# EAGLE design Power_Amp_carlos (EAGLE 6.5.0)
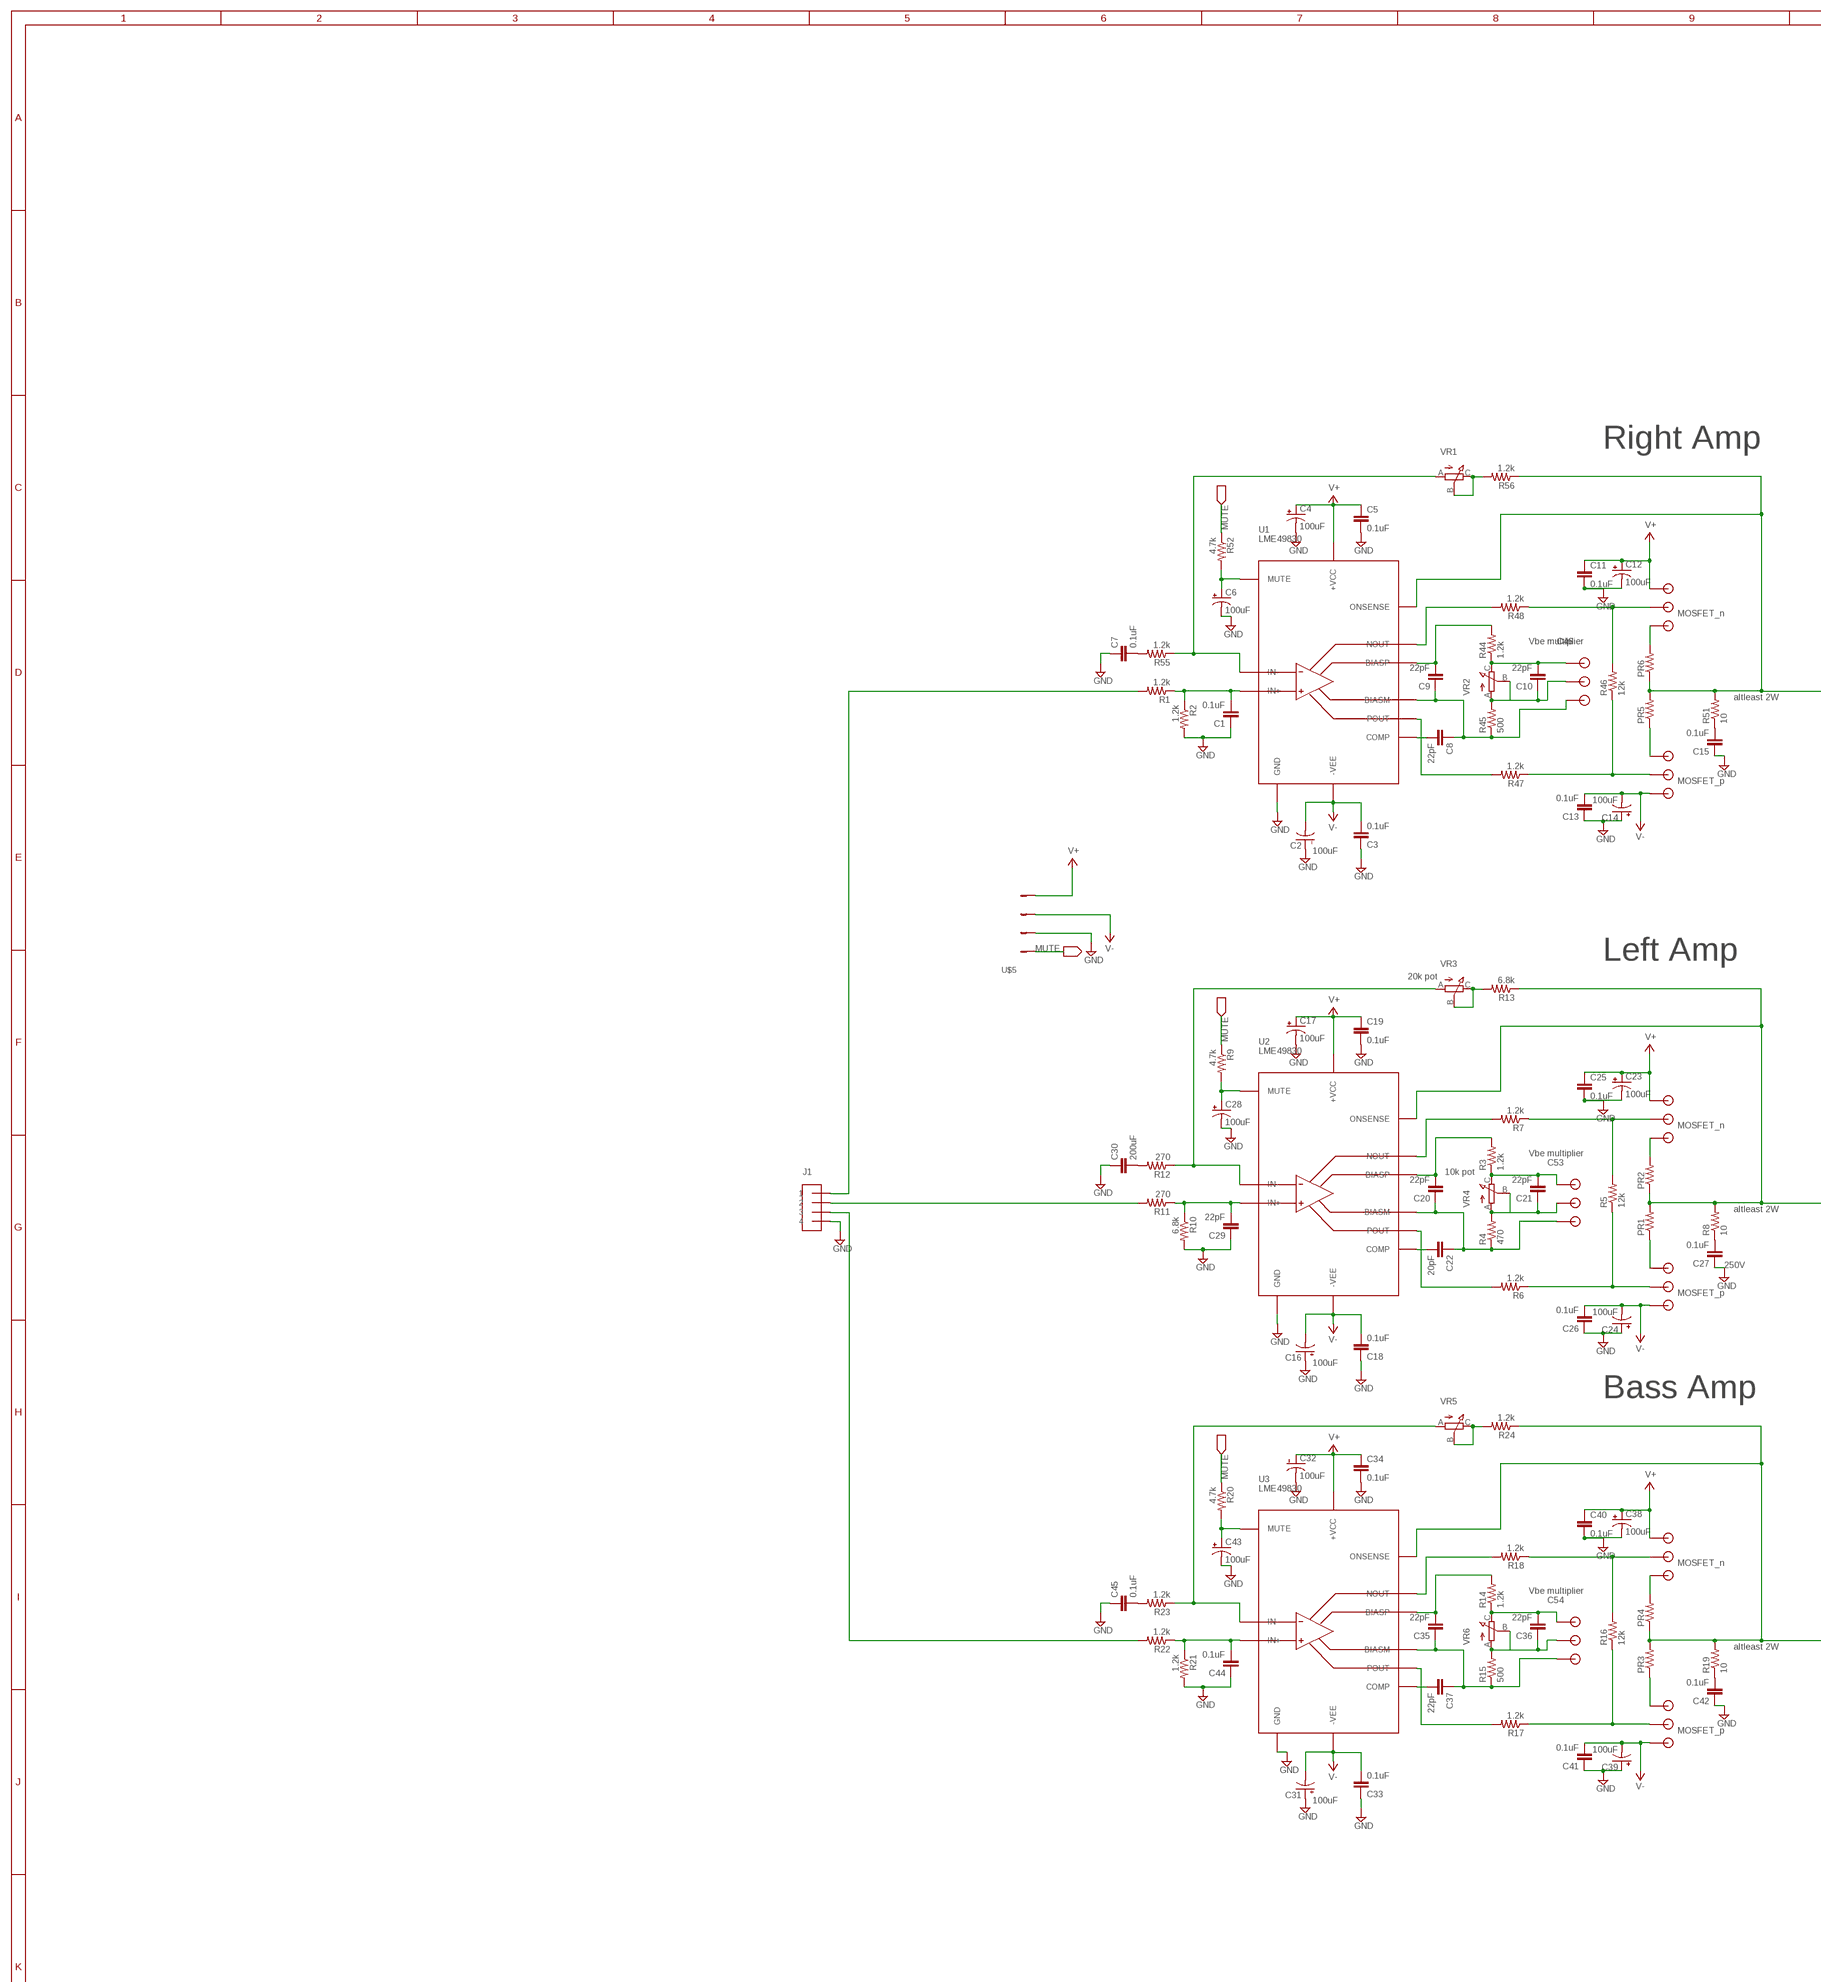
[diagram p0: schematic, sheet 1, part 1 of 3]
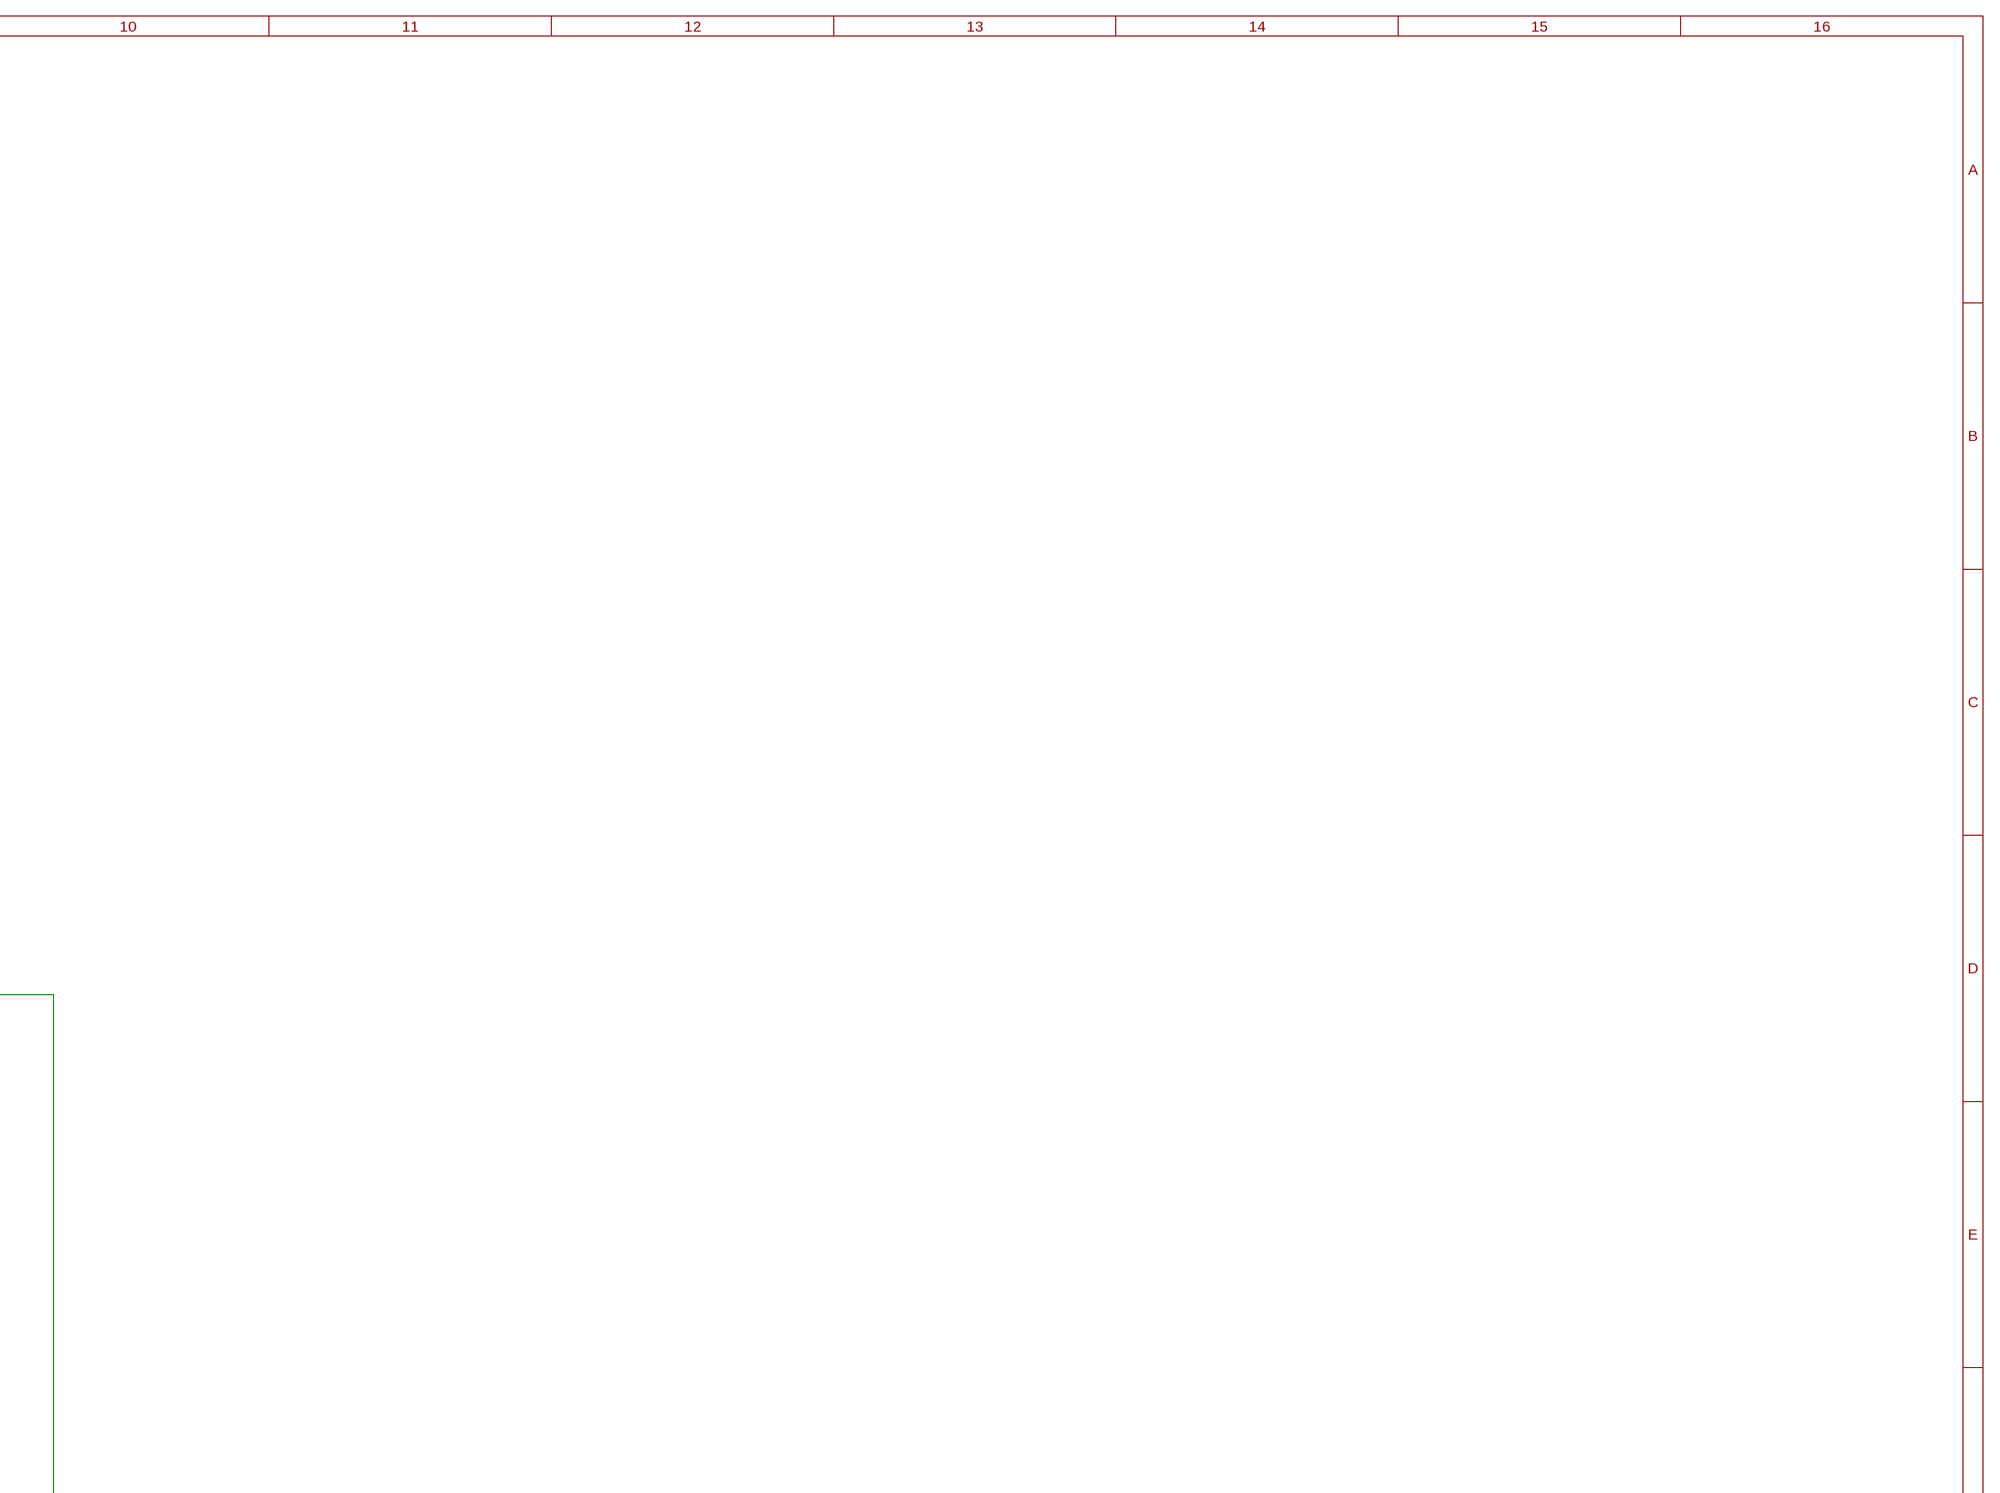
[diagram p1: schematic, sheet 1, part 2 of 3]
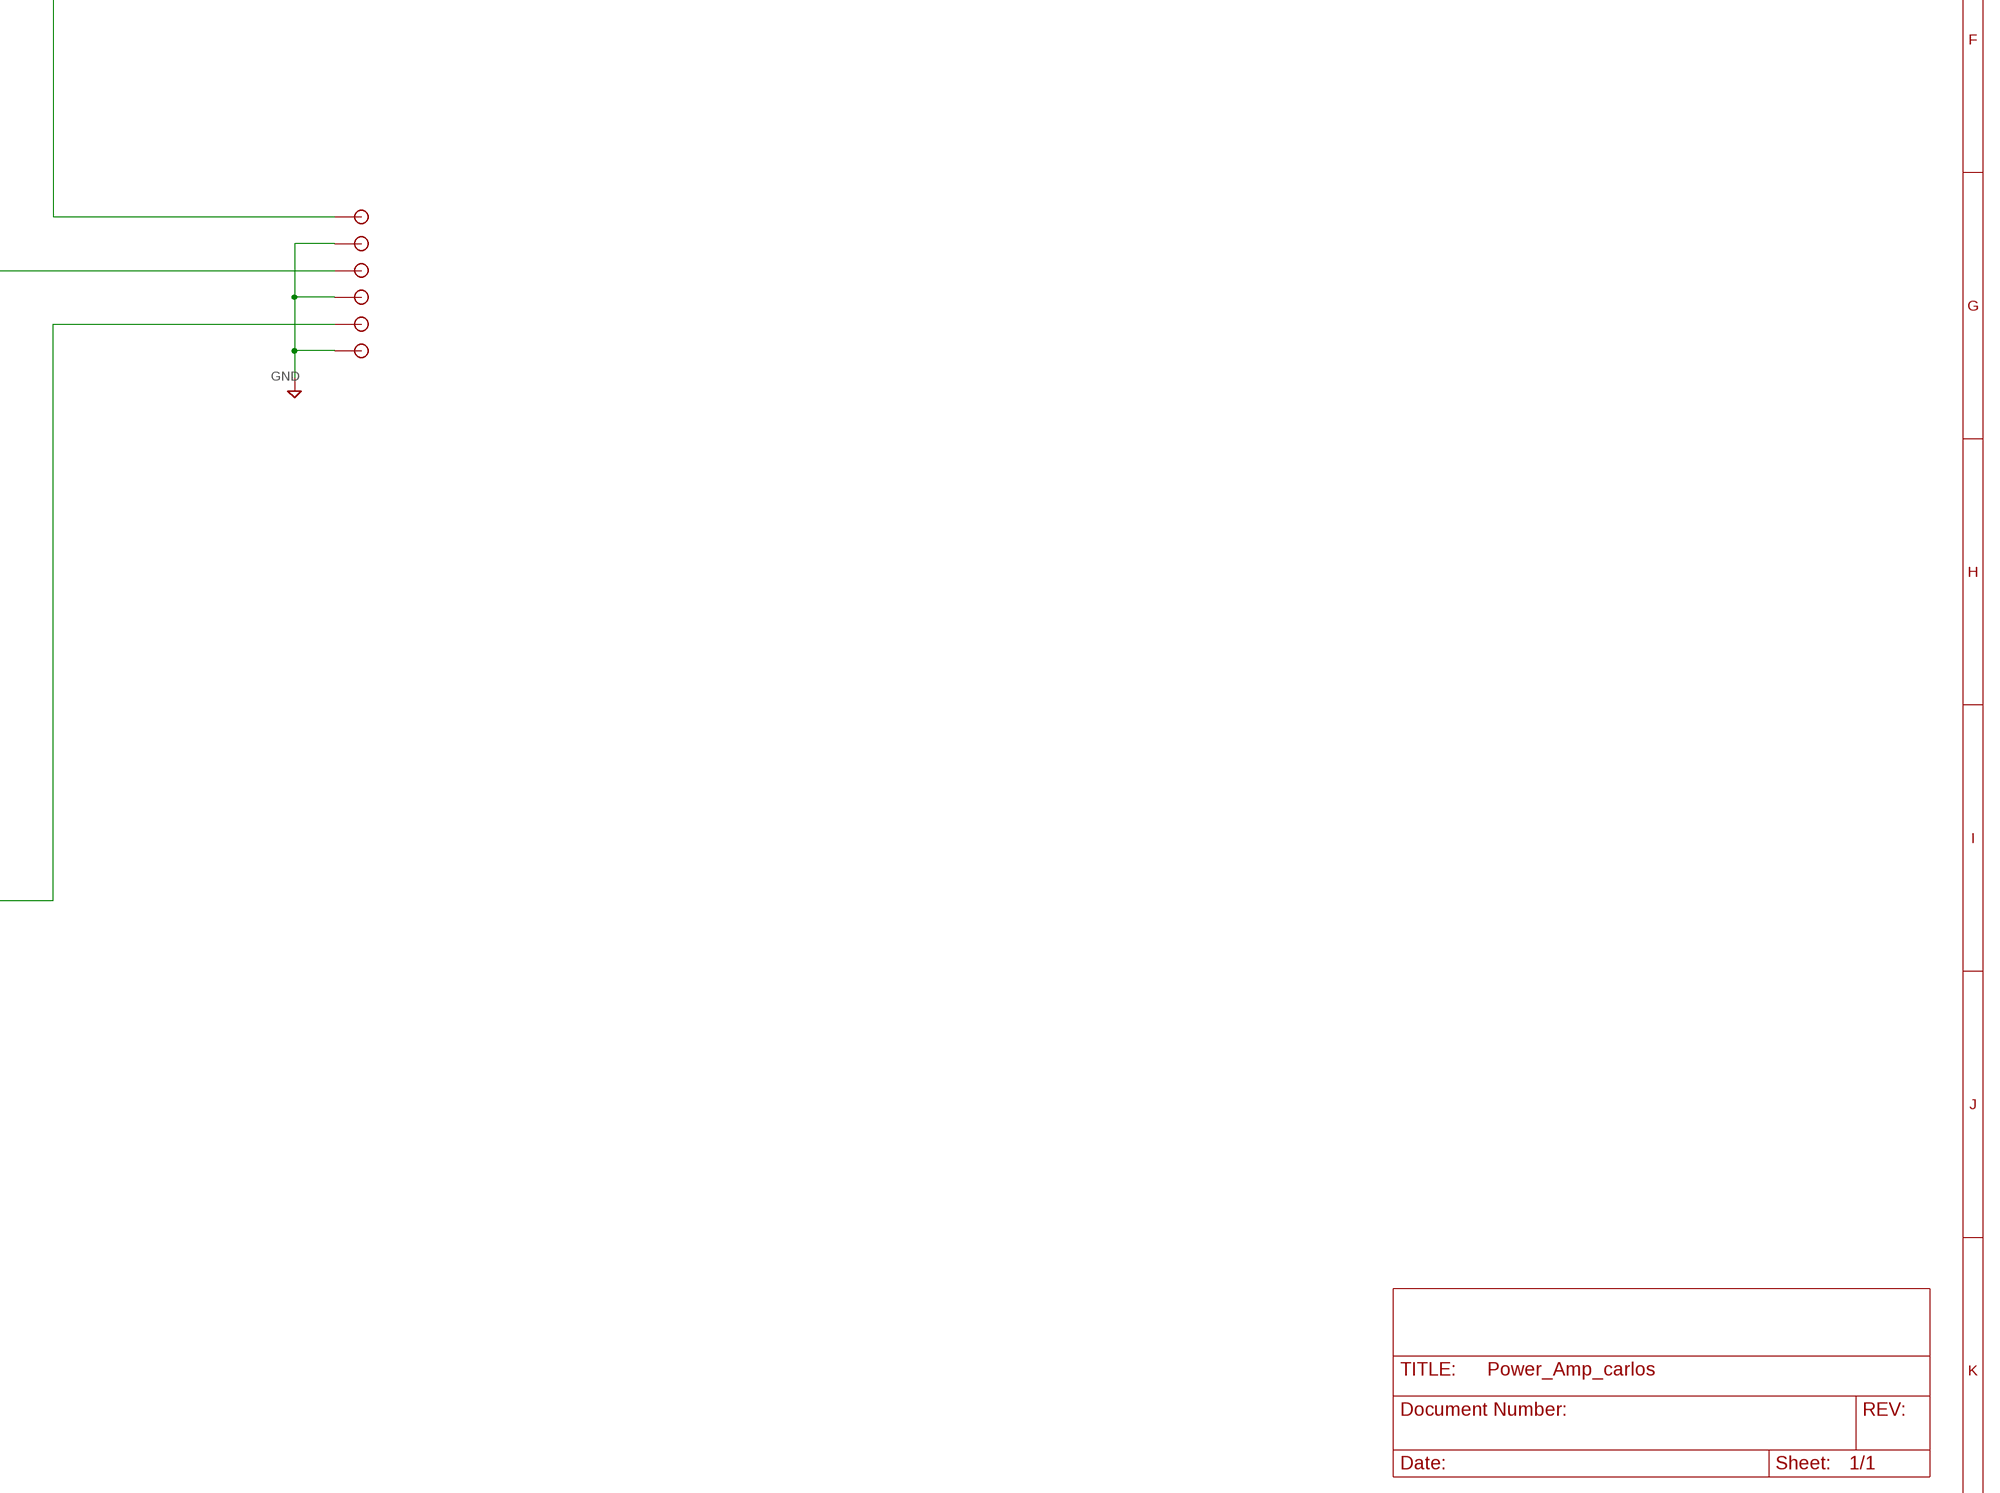
[diagram p2: schematic, sheet 1, part 3 of 3]

## Parts
C1  0.1uF  C-EU050-024X044  [C050-024X044]
C2  100uF  CPOL-USE2.5-6  [E2,5-6]
C3  0.1uF  C-EU050-024X044  [C050-024X044]
C4  100uF  CPOL-USE2.5-6  [E2,5-6]
C5  0.1uF  C-EU050-024X044  [C050-024X044]
C6  100uF  CPOL-USE2.5-6  [E2,5-6]
C7  0.1uF  C-EU050-024X044  [C050-024X044]
C8  22pF  C-EU050-024X044  [C050-024X044]
C9  22pF  C-EU050-024X044  [C050-024X044]
C10  22pF  C-EU050-024X044  [C050-024X044]
C11  0.1uF  C-EU050-024X044  [C050-024X044]
C12  100uF  CPOL-USE2.5-6  [E2,5-6]
C13  0.1uF  C-EU050-024X044  [C050-024X044]
C14  100uF  CPOL-USE2.5-6  [E2,5-6]
C15  0.1uF  C-EU050-024X044  [C050-024X044]
C16  100uF  CPOL-USE2.5-6  [E2,5-6]
C17  100uF  CPOL-USE2.5-6  [E2,5-6]
C18  0.1uF  C-EU050-024X044  [C050-024X044]
C19  0.1uF  C-EU050-024X044  [C050-024X044]
C20  22pF  C-EU050-024X044  [C050-024X044]
C21  22pF  C-EU050-024X044  [C050-024X044]
C22  20pF  C-EU050-024X044  [C050-024X044]
C23  100uF  CPOL-USE2.5-6  [E2,5-6]
C24  100uF  CPOL-USE2.5-6  [E2,5-6]
C25  0.1uF  C-EU050-024X044  [C050-024X044]
C26  0.1uF  C-EU050-024X044  [C050-024X044]
C27  0.1uF  C-EU050-024X044  [C050-024X044]
C28  100uF  CPOL-USE2.5-6  [E2,5-6]
C29  22pF  C-EU050-024X044  [C050-024X044]
C30  200uF  C-EU050-024X044  [C050-024X044]
C31  100uF  CPOL-USE2.5-6  [E2,5-6]
C32  100uF  CPOL-USE2.5-6  [E2,5-6]
C33  0.1uF  C-EU050-024X044  [C050-024X044]
C34  0.1uF  C-EU050-024X044  [C050-024X044]
C35  22pF  C-EU050-024X044  [C050-024X044]
C36  22pF  C-EU050-024X044  [C050-024X044]
C37  22pF  C-EU050-024X044  [C050-024X044]
C38  100uF  CPOL-USE2.5-6  [E2,5-6]
C39  100uF  CPOL-USE2.5-6  [E2,5-6]
C40  0.1uF  C-EU050-024X044  [C050-024X044]
C41  0.1uF  C-EU050-024X044  [C050-024X044]
C42  0.1uF  C-EU050-024X044  [C050-024X044]
C43  100uF  CPOL-USE2.5-6  [E2,5-6]
C44  0.1uF  C-EU050-024X044  [C050-024X044]
C45  0.1uF  C-EU050-024X044  [C050-024X044]
C46  OSTVN03A150  [OSTVN03A150]
C47  1984620  [1984620]
C48  1984620  [1984620]
C49  1984620  [1984620]
C50  1984620  [1984620]
C51  1984620  [1984620]
C52  1984620  [1984620]
C53  OSTVN03A150  [OSTVN03A150]
C54  OSTVN03A150  [OSTVN03A150]
C55  1984659  [1984659]
J1  4_PIN_AMPCONN  [4_PIN_AMPCON]
PR1  R-US_0617/5V  [0617V]
PR2  R-US_0617/5V  [0617V]
PR3  R-US_0617/5V  [0617V]
PR4  R-US_0617/5V  [0617V]
PR5  R-US_0617/5V  [0617V]
PR6  R-US_0617/5V  [0617V]
R1  1.2k  R-US_0204/2V  [0204V]
R2  1.2k  R-US_0204/2V  [0204V]
R3  1.2k  R-US_0204/2V  [0204V]
R4  470  R-US_0204/2V  [0204V]
R5  12k  R-US_0204/2V  [0204V]
R6  1.2k  R-US_0204/2V  [0204V]
R7  1.2k  R-US_0204/2V  [0204V]
R8  10  R-US_0617/5V  [0617V]
R9  4.7k  R-US_0204/2V  [0204V]
R10  6.8k  R-US_0204/2V  [0204V]
R11  270  R-US_0204/2V  [0204V]
R12  270  R-US_0204/2V  [0204V]
R13  6.8k  R-US_0204/2V  [0204V]
R14  1.2k  R-US_0204/2V  [0204V]
R15  500  R-US_0204/2V  [0204V]
R16  12k  R-US_0204/2V  [0204V]
R17  1.2k  R-US_0204/2V  [0204V]
R18  1.2k  R-US_0204/2V  [0204V]
R19  10  R-US_0617/5V  [0617V]
R20  4.7k  R-US_0204/2V  [0204V]
R21  1.2k  R-US_0204/2V  [0204V]
R22  1.2k  R-US_0204/2V  [0204V]
R23  1.2k  R-US_0204/2V  [0204V]
R24  1.2k  R-US_0204/2V  [0204V]
R44  1.2k  R-US_0204/2V  [0204V]
R45  500  R-US_0204/2V  [0204V]
R46  12k  R-US_0204/2V  [0204V]
R47  1.2k  R-US_0204/2V  [0204V]
R48  1.2k  R-US_0204/2V  [0204V]
R51  10  R-US_0617/5V  [0617V]
R52  4.7k  R-US_0204/2V  [0204V]
R55  1.2k  R-US_0204/2V  [0204V]
R56  1.2k  R-US_0204/2V  [0204V]
U1  LME49830  [NDN0015A]
U2  LME49830  [NDN0015A]
U3  LME49830  [NDN0015A]
U$5  SCREW_TERMINAL_4  [SCREW_TERMINAL_4]
VR1  EVM2W  [EVM2W]
VR2  EVM2W  [EVM2W]
VR3  EVM2W  [EVM2W]
VR4  EVM2W  [EVM2W]
VR5  EVM2W  [EVM2W]
VR6  EVM2W  [EVM2W]

## Nets
BASS: J1.3 R22.2
GND: C1.1 C2.+ C3.1 C4.- C5.2 C6.- C7.1 C11.2 C12.- C13.1 C14.+ C15.1 C16.+ C17.- C18.1 C19.2 C23.- C24.+ C25.2 C26.1 C27.1 C28.- C29.1 C30.1 C31.+ C32.- C33.1 C34.2 C38.- C39.+ C40.2 C41.1 C42.1 C43.- C44.1 C45.1 C55.P$2 C55.P$4 C55.P$6 J1.4 R2.2 R10.2 R21.2 U1.P3(GND) U2.P3(GND) U3.P3(GND) U$5.2(S2)
LEFT: J1.2 R11.2
MUTE: R9.1 R20.1 R52.1 U$5.1(S1)
N$1: C21.2 C53.P$1 R3.1 VR4.C
N$2: C21.1 C53.P$2 R4.2 VR4.A VR4.B
N$3: C20.2 R3.2 U2.P12(BIASP)
N$4: R48.2 U1.P14(NOUT)
N$5: C20.1 C22.1 C53.P$3 R4.1 U2.P11(BIASM)
N$6: C22.2 U2.P6(COMP)
N$7: R6.2 U2.P13(POUT)
N$8: C50.P$2 R5.2 R7.1
N$9: C49.P$2 R5.1 R6.1
N$11: C50.P$3 PR2.2
N$12: C55.P$3 PR1.2 PR2.1 R8.2 R13.1 U2.P$8(ONSENSE)
N$13: C27.2 R8.1
N$14: C28.+ R9.2 U2.P2(MUTE)
N$15: R7.2 U2.P14(NOUT)
N$16: C1.2 R1.1 R2.1 U1.P4(IN+)
N$17: C29.2 R10.1 R11.1 U2.P4(IN+)
N$18: C30.2 R12.2
N$19: R12.1 U2.P5(IN-) VR3.A
N$20: R13.2 VR3.B VR3.C
N$22: C49.P$1 PR1.1
N$23: C36.2 C54.P$1 R14.1 VR6.C
N$24: C36.1 C54.P$2 R15.2 VR6.A VR6.B
N$25: C35.2 R14.2 U3.P12(BIASP)
N$26: C35.1 C37.1 C54.P$3 R15.1 U3.P11(BIASM)
N$27: C37.2 U3.P6(COMP)
N$28: R17.2 U3.P13(POUT)
N$30: C51.P$2 R16.2 R18.1
N$31: R55.1 U1.P5(IN-) VR1.A
N$32: C52.P$2 R16.1 R17.1
N$33: C51.P$3 PR4.2
N$35: C42.2 R19.1
N$36: C7.2 R55.2
N$37: C43.+ R20.2 U3.P2(MUTE)
N$38: R18.2 U3.P14(NOUT)
N$39: C44.2 R21.1 R22.1 U3.P4(IN+)
N$40: R56.2 VR1.B VR1.C
N$41: C45.2 R23.2
N$42: R23.1 U3.P5(IN-) VR5.A
N$43: R24.2 VR5.B VR5.C
N$45: C52.P$1 PR3.1
N$65: C10.2 C46.P$1 R44.1 VR2.C
N$66: C8.2 U1.P6(COMP)
N$67: C8.1 C9.1 C46.P$3 R45.1 U1.P11(BIASM)
N$68: C10.1 C46.P$2 R45.2 VR2.A VR2.B
N$69: C9.2 R44.2 U1.P12(BIASP)
N$70: R47.2 U1.P13(POUT)
N$72: C47.P$2 R46.2 R48.1
N$73: C48.P$2 R46.1 R47.1
N$74: C47.P$3 PR6.2
N$75: C55.P$1 PR5.2 PR6.1 R51.2 R56.1 U1.P$8(ONSENSE)
N$77: C55.P$5 PR3.2 PR4.1 R19.2 R24.1 U3.P$8(ONSENSE)
N$84: C15.2 R51.1
N$85: C6.+ R52.2 U1.P2(MUTE)
N$110: C48.P$1 PR5.1
RIGHT: J1.1 R1.2
V+: C4.+ C5.1 C11.1 C12.+ C17.+ C19.1 C23.+ C25.1 C32.+ C34.1 C38.+ C40.1 C47.P$1 C50.P$1 C51.P$1 U1.P15(+VCC) U2.P15(+VCC) U3.P15(+VCC) U$5.4(S4)
V-: C2.- C3.2 C13.2 C14.- C16.- C18.2 C24.- C26.2 C31.- C33.2 C39.- C41.2 C48.P$3 C49.P$3 C52.P$3 U1.P10(-VEE) U2.P10(-VEE) U3.P10(-VEE) U$5.3(S3)

## Notes on the sheet
- Right Amp
- MOSFET_n
- Vbe multiplier
- altleast 2W
- MOSFET_p
- Left Amp
- 20k pot
- MOSFET_n
- Vbe multiplier
- 10k pot
- altleast 2W
- 250V
- MOSFET_p
- Bass Amp
- MOSFET_n
- Vbe multiplier
- altleast 2W
- MOSFET_p

## Library data of the parts
C1 C3 C5 C7-C11 C13 C15 C18-C22 C25-C27 C29 C30 C33-C37 C40-C42 C44 C45 = rcl:C-EU: CAPACITOR, European symbol
C2 C4 C6 C12 C14 C16 C17 C23 C24 C28 C31 C32 C38 C39 C43 = rcl:CPOL-US: POLARIZED CAPACITOR, American symbol
C46 C53 C54 = Amplifier_Parts:OSTVN03A150
C47-C52 = Amplifier_Parts:1984620
C55 = Amplifier_Parts:1984659
J1 = Amplifier_Parts:4_PIN_AMPCONN
PR1-PR6 R1-R24 R44-R48 R51 R52 R55 R56 = rcl:R-US_: RESISTOR, American symbol
U1-U3 = LME49830_1:LME49830: Mono High Fidelity 200 Volt MOSFET Power Amplifier Input Stage with Mute Datasheet: http://www.ti.com/lit/ds/symlink/lme49830.pdf
U$5 = Amplifier_Parts:SCREW_TERMINAL_4
VR1-VR6 = Amplifier_Parts:EVM2W

## Board
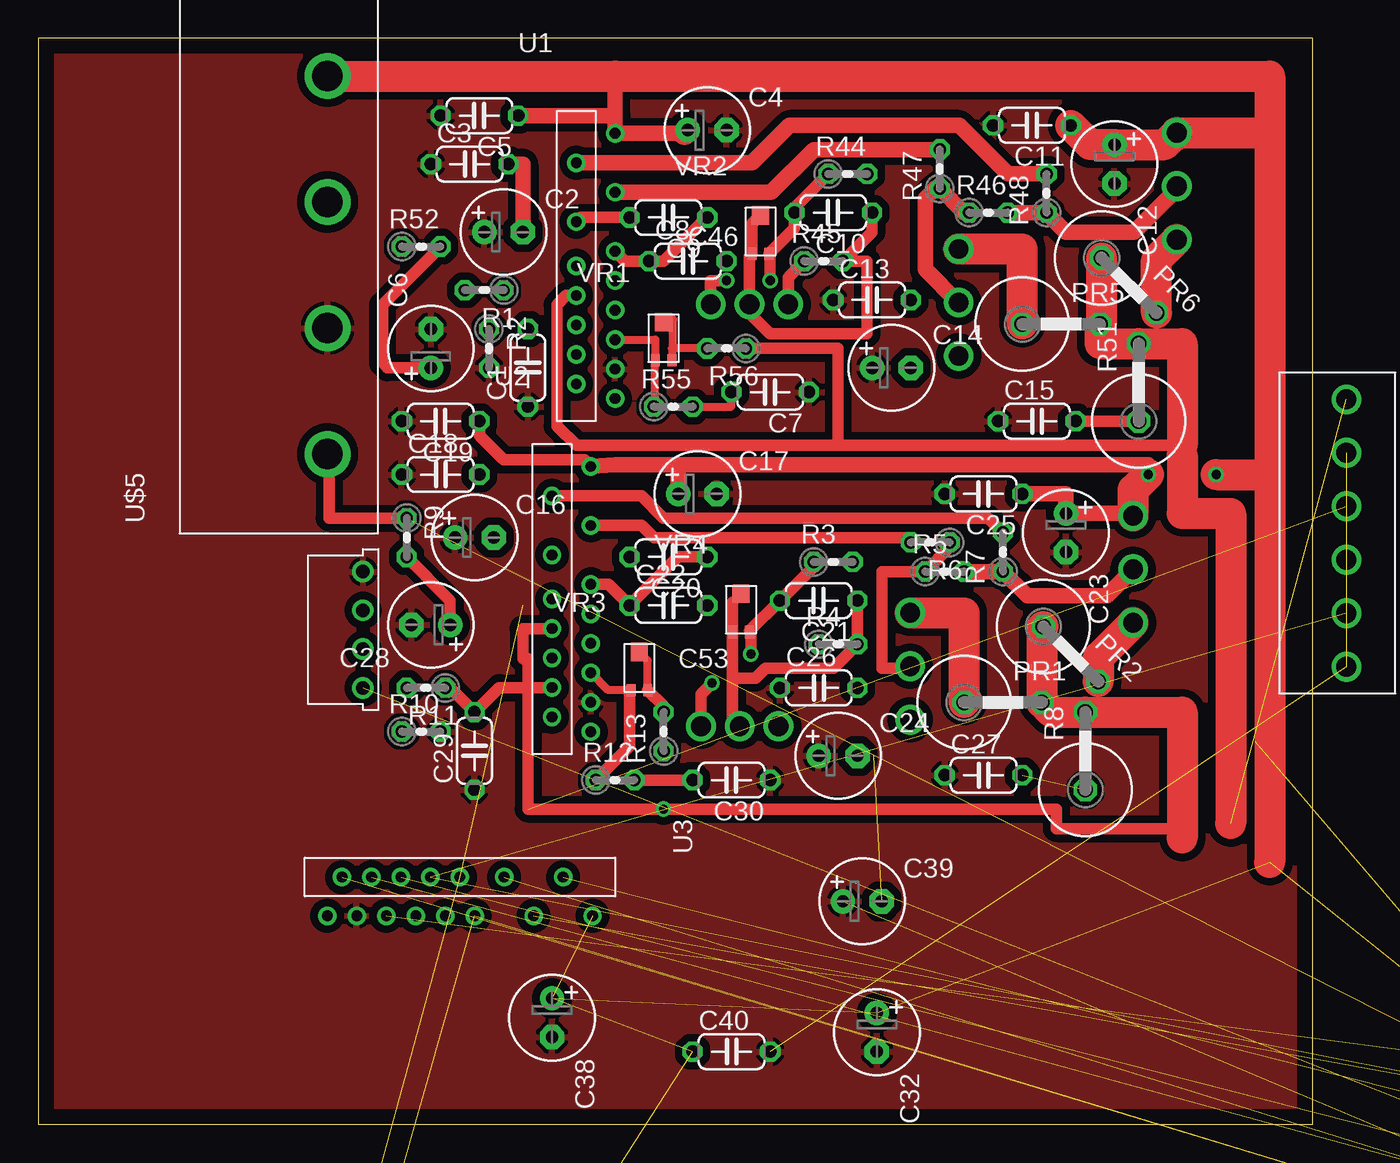
[diagram p3: board, top side]
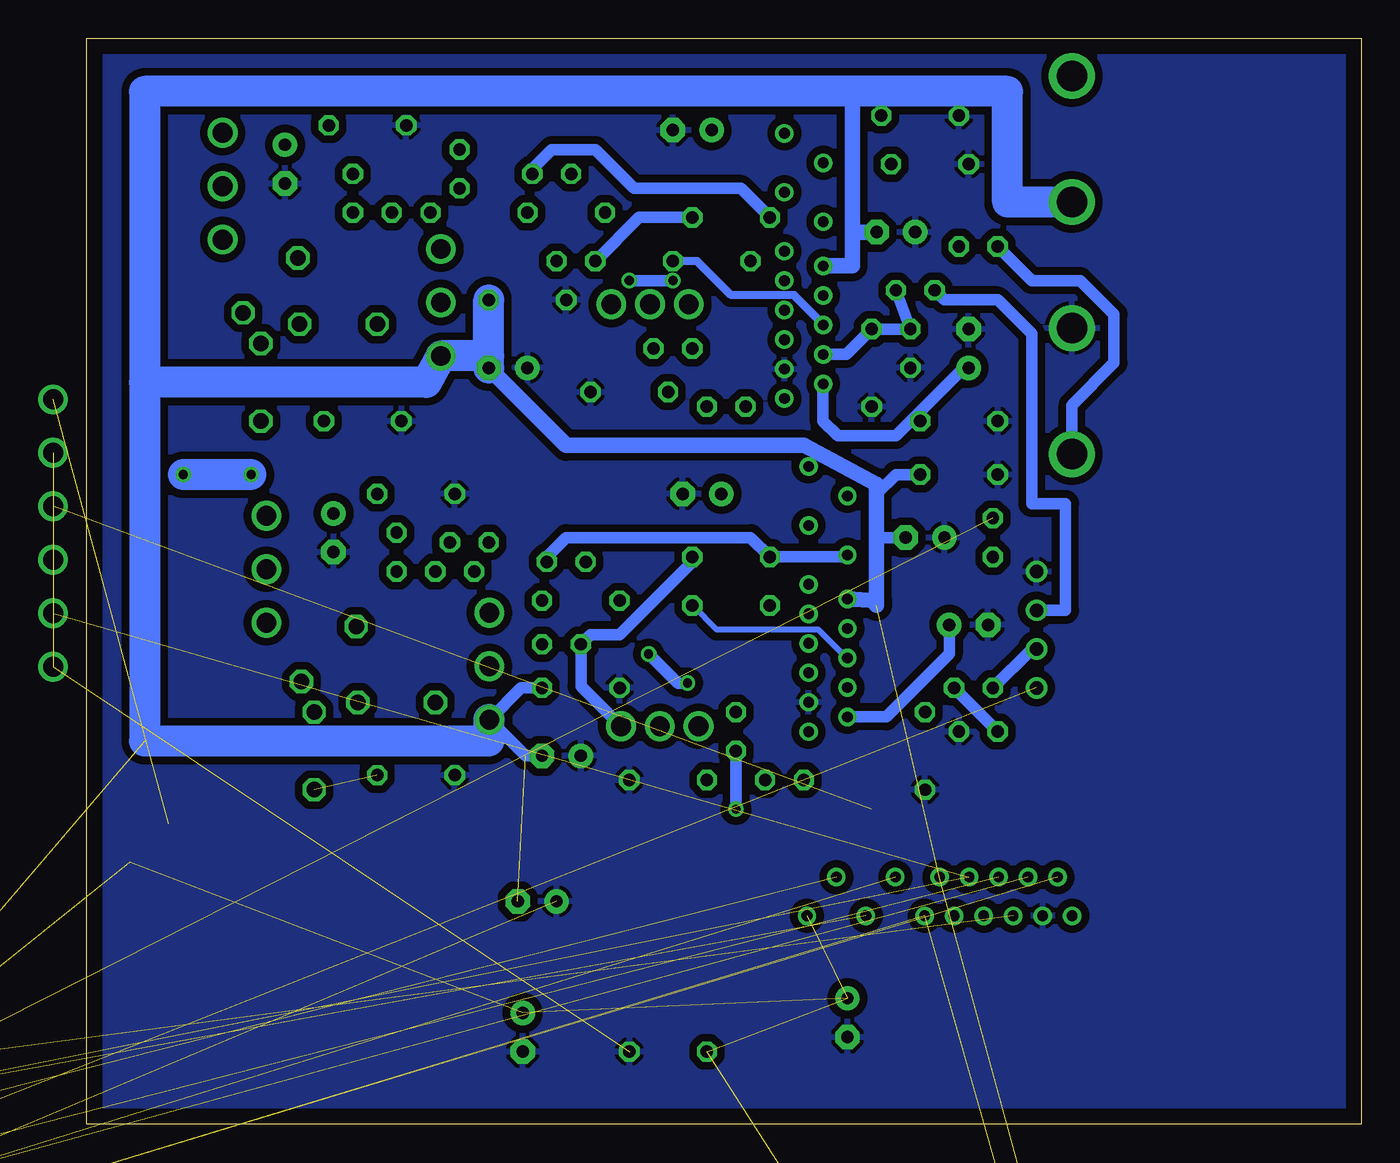
[diagram p4: board, bottom side, seen from below]

Size 83.49 x 71.11 mm. Coordinates in mm from the lower left corner, seen from the top.
Outline: 0,0 83.49,0 83.49,71.11 0,71.11 0,0
Copper layers (1*16): Top 0.035mm / dielectric 1.5mm / Bottom 0.035mm
Design rules "default": minimum track width 10mil, minimum drill 24mil, track to track 8mil, track to pad 8mil, pad to pad 8mil, via to via 8mil, smd to smd 8mil, copper to edge 40mil, drill to drill 8mil, minimum pad ring 10mil, minimum via ring 8mil, stop-mask expansion 4mil, vias tented up to drill 0mil, thermal gap 10mil

### Footprints (pad centres in the part's own frame; a part is rotated, then mirrored left to right if it is on the bottom)
C050-024X044 = drill 0.813 octagon: 1 -2.54,0; 2 2.54,0
E2,5-6 = drill 0.813 pad 1.6: + -1.27,0 | drill 0.813 pad 1.6 octagon: - 1.27,0
OSTVN03A150 = drill 1.3: P$1 1.5,3.2; P$2 4.04,3.2; P$3 6.58,3.2
1984620 = drill 1.3: P$1 1.75,4.4; P$2 5.25,4.4; P$3 8.75,4.4
1984659 = drill 1.3: P$1 1.75,4.4; P$2 5.25,4.4; P$3 8.75,4.4; P$4 12.25,4.4; P$5 15.75,4.4; P$6 19.25,4.4
4_PIN_AMPCON = drill 0.89: 1 1.27,0; 2 -1.27,0; 3 -3.81,0; 4 3.81,0
0617V = drill 1.016 octagon: 1 -2.54,0; 2 2.54,0
0204V = drill 0.813 octagon: 1 -1.27,0; 2 1.27,0
NDN0015A = drill 0.7: P1 5.08,-8.685; P2 2.54,-7.72; P3 5.08,-6.755; P4 2.54,-5.79; P5 5.08,-4.825; P6 2.54,-3.86; P7 5.08,-2.895; P9 5.08,-0.965; P10 2.54,0; P11 5.08,0.965; P12 2.54,2.895; P13 5.08,4.825; P14 2.54,6.755; P15 5.08,8.685; P$8 2.54,-1.93
SCREW_TERMINAL_4 = drill 2: 1 -13.27,0.73; 2 -5.02,0.73; 3 3.23,0.73; 4 11.48,0.73
EVM2W = smd 0.575 x 0.8: A -0.55,-1.1; C 0.55,-1.1 | smd 1.1 x 1.2: B 0,1.4

### Placement (x,y rotation side)
C1  32.07,49.53 90 top
C2  30.48,58.42 0 top
C3  28.26,62.87 0 top
C4  43.81,65.09 0 top
C5  28.89,66.04 180 top
C6  25.72,50.8 90 top
C7  47.94,47.94 180 top
C8  42.55,56.52 0 top
C9  41.27,59.37 180 top
C10  52.07,59.69 180 top
C11  65.09,65.41 180 top
C12  70.48,62.87 270 top
C13  54.61,53.98 0 top
C14  55.88,49.53 0 top
C15  65.41,46.04 0 top
C16  28.57,38.42 0 top
C17  43.18,41.27 0 top
C18  26.35,42.55 0 top
C19  26.35,46.04 180 top
C20  41.27,37.15 180 top
C21  51.12,34.29 180 top
C22  41.27,33.97 0 top
C23  67.31,38.73 270 top
C24  52.39,24.13 0 top
C25  61.91,41.27 180 top
C26  51.12,28.57 0 top
C27  61.91,22.86 0 top
C28  25.72,32.7 180 top
C29  28.57,24.45 90 top
C30  45.4,22.54 180 top
C31  102.23,-14.61 270 top  (outside the outline)
C32  54.93,6.03 270 top
C33  103.5,-5.71 0 top  (outside the outline)
C34  108.58,-3.17 0 top  (outside the outline)
C35  107.31,-9.53 0 top  (outside the outline)
C36  146.69,-22.23 0 top  (outside the outline)
C37  116.2,-8.26 0 top  (outside the outline)
C38  33.66,6.99 270 top
C39  53.98,14.61 0 top
C40  45.4,4.76 0 top
C41  146.69,-1.91 0 top  (outside the outline)
C42  146.69,-12.06 0 top  (outside the outline)
C43  117.47,-14.61 270 top  (outside the outline)
C44  122.56,-12.06 0 top  (outside the outline)
C45  153.03,-5.71 0 top  (outside the outline)
C46  42.55,50.48 0 top
C47  70.17,66.67 270 top
C48  55.88,59.05 270 top
C49  52.7,35.24 270 top
C50  67.31,41.59 270 top
C51  -5.71,-72.71 0 top  (outside the outline)
C52  -6.67,-81.6 0 top  (outside the outline)
C53  41.91,22.86 0 top
C54  -8.57,-96.84 0 top  (outside the outline)
C55  81.28,49.21 270 top
J1  21.27,32.38 90 top
PR1  63.18,27.62 0 top
PR2  67.63,30.8 315 top
PR3  164.47,-4.45 180 top  (outside the outline)
PR4  164.47,-14.61 180 top  (outside the outline)
PR5  66.99,52.39 0 top
PR6  71.44,54.93 315 top
R1  29.21,54.61 180 top
R2  29.53,50.8 270 top
R3  52.07,36.83 0 top
R4  52.39,31.43 0 top
R5  59.37,36.2 0 top
R6  58.42,38.1 180 top
R7  63.18,37.47 90 top
R8  68.58,24.45 90 top
R9  24.13,38.42 270 top
R10  25.08,25.72 0 top
R11  25.4,28.57 180 top
R12  37.78,22.54 0 top
R13  40.96,25.72 90 top
R14  99.69,-5.71 0 top  (outside the outline)
R15  112.39,-6.99 0 top  (outside the outline)
R16  128.91,-10.79 0 top  (outside the outline)
R17  130.18,-4.45 0 top  (outside the outline)
R18  128.91,-8.26 0 top  (outside the outline)
R19  153.03,-12.06 0 top  (outside the outline)
R20  122.56,-9.53 0 top  (outside the outline)
R21  126.36,-18.41 0 top  (outside the outline)
R22  128.91,-14.61 0 top  (outside the outline)
R23  151.76,-3.17 0 top  (outside the outline)
R24  149.22,-8.26 0 top  (outside the outline)
R44  53.02,62.23 0 top
R45  51.44,56.52 0 top
R46  62.23,59.69 0 top
R47  59.05,62.55 90 top
R48  66.04,60.96 90 top
R51  72.07,48.58 90 top
R52  25.08,57.47 0 top
R55  41.59,46.99 0 top
R56  45.09,50.8 180 top
U1  32.7,56.2 0 top
U2  31.11,34.39 0 top
U3  27.62,18.73 270 top
U$5  19.68,57.15 90 top
VR1  40.96,51.12 0 top
VR2  47.31,58.1 0 top
VR3  39.37,29.53 0 top
VR4  46.04,33.34 0 top
VR5  155.57,-18.41 0 top  (outside the outline)
VR6  150.5,-18.41 0 top  (outside the outline)

### Tracks (layer width: path | path; a pad name or v marks a point on that pad's centre or on a via)
BASS  (1 unrouted)
GND  (12 unrouted)
  pour Top (isolate 0.508): -1.27,0 82.55,0 82.55,71.12 -1.27,71.12
  pour Bottom (isolate 0.508): -1.59,0 82.23,0 82.23,71.12 -1.59,71.12
LEFT
  Bottom 0.762: J1.2 21.59,31.11 R11.2
MUTE  (1 unrouted)
  Top 0.762: U$5.1 19.05,43.88 19.05,39.69 R9.1
  Bottom 0.762: U$5.1 18.95,47.09 16.19,49.85 16.19,53.02 18.41,55.24 21.59,55.24 R52.1
N$1  (via drill 0.6)
  Top 0.381: 46.67,32.15 VR4.C
  Top 0.762: R3.1 50.8,36.51 C21.2 46.59,32.3 VR4.C | C53.P$1 43.41,28.17 v44.13,28.89 | v46.67,30.8 46.67,32.15
  Bottom 0.762: v44.13,28.89 44.77,28.89 v46.67,30.8
N$2
  Top 0.381: 45.49,34.19 VR4.B
  Top 0.762: 45.49,34.19 VR4.A 45.49,29.21 | 45.49,29.21 45.49,26.52 C53.P$2 | C21.1 R4.2 52.07,29.84 47.62,29.84 46.99,29.21 45.49,29.21
N$3
  Bottom 0.762: R3.2 53.34,37.15 52.07,38.42 40.01,38.42 C20.2 33.79,37.15 U2.P12
N$4
  Top 1.016: U1.P14 46.76,62.95 49.21,65.41 60.33,65.41 63.5,62.23 R48.2
N$5
  Top 0.762: U2.P11 37.35,35.35 C22.1 41.91,37.15 C20.1
  Bottom 0.762: C53.P$3 51.12,28.69 R4.1 50.48,32.07 48.58,32.07 43.81,36.83 C20.1
N$6
  Bottom 0.381: 33.66,30.8 33.97,30.8 35.56,32.38 42.23,32.38 C22.2
  Bottom 0.508: U2.P6 33.66,30.8
N$7
  Top 0.762: U2.P13 39.52,39.22 40.32,38.42 56.83,38.42 R6.2
N$8
  Top 1.016: C50.P$2 69.97,34.61 64.77,34.61 R7.1 R5.2
N$9
  Top 0.762: R6.1 59.69,37.78 R5.1 55.24,36.2 55.24,29.84 57.1,29.84 C49.P$2
N$11
  Top 2.032: C50.P$3 69.42,30.56 PR2.2
N$12  (via drill 0.6)  (1 unrouted)
  Top 0.762: U2.P$8 31.75,32.46 31.75,30.48 32.07,30.48 32.07,20.64 v40.96,20.64 66.67,20.64 66.67,19.37 74.93,19.37
  Top 2.032: PR2.1 65.72,32.48 PR1.2 66.36,26.99 R8.2 74.93,26.99 74.93,19.37 74.93,18.73
  Bottom 0.762: R13.1 v40.96,20.64
N$13  (1 unrouted)
N$14
  Top 0.762: R9.2 26.99,34.29 C28.+
  Bottom 0.762: C28.+ 26.99,30.8 31.11,26.67 U2.P2
N$15
  Top 0.762: R7.2 62.23,39.69 40.96,39.69 39.5,41.15 U2.P14
N$16
  Bottom 0.762: R1.1 R2.1 C1.2 33.73,50.41 U1.P4
N$17
  Top 0.762: R11.1 26.99,28.57 C29.2 30.19,28.6 U2.P4
  Bottom 0.762: R11.1 R10.1
N$18
  Top 0.762: R12.2 C30.2
N$19
  Top 0.508: 38.73,28.34 VR3.A 37.33,28.43 U2.P5
  Top 0.762: 38.73,28.34 38.73,24.77 R12.1
N$20
  Top 0.508: VR3.C 39.92,30.38 VR3.B
  Top 0.762: R13.2 40.96,27.39 VR3.C
N$22
  Top 2.032: C49.P$1 60.64,33.49 PR1.1
N$23  (3 unrouted)
N$24  (4 unrouted)
N$25  (2 unrouted)
N$26  (4 unrouted)
N$27  (1 unrouted)
N$28  (1 unrouted)
N$30  (2 unrouted)
N$31
  Top 0.508: U1.P5 40.41,51.37 VR1.A 40.41,46.99 R55.1
N$32  (2 unrouted)
N$33  (1 unrouted)
N$35  (1 unrouted)
N$36
  Top 0.508: R55.2 45.4,46.99 C7.2
N$37  (2 unrouted)
N$38  (1 unrouted)
N$39  (3 unrouted)
N$40
  Top 0.508: R56.2 41.59,50.8 | VR1.C 41.51,50.8 41.59,50.8 | 41.59,50.8 41.59,52.7 40.96,52.7 VR1.B
N$41  (1 unrouted)
N$42  (2 unrouted)
N$43  (2 unrouted)
N$45  (1 unrouted)
N$65  (via drill 0.6)
  Top 0.762: R44.1 49.53,60.01 C10.2 49.53,58.67 VR2.C 47.94,57 v47.94,55.24 | C46.P$1 44.05,55.24 v45.09,55.24
  Bottom 0.762: v45.09,55.24 v47.94,55.24
N$66
  Bottom 0.508: 35.24,52.39 37.15,54.29 41.27,54.29 43.5,56.52 C8.2
  Bottom 1.016: U1.P6 35.24,52.39
N$67
  Top 0.762: U1.P11 38.43,56.52 C8.1 40.96,56.52 C9.1 | C46.P$3 49.12,55.48 R45.1
  Bottom 0.762: C9.1 47.31,59.37 R45.1
N$68
  Top 0.762: C10.1 54.61,58.42 R45.2 54.29,56.52 54.29,51.75 47.94,51.75 46.59,53.11 C46.P$2 46.59,56.83 VR2.A 46.76,58.95 VR2.B
N$69
  Top 0.762: U1.P12 35.52,59.37 C9.2
  Bottom 0.762: C9.2 40.64,61.28 47.62,61.28 50.16,63.82 53.02,63.82 54.29,62.55 R44.2
N$70
  Top 1.016: U1.P13 48.01,61.02 50.8,63.82 R47.2
N$72
  Top 0.762: C47.P$2 74.57,61.23
  Top 1.016: 74.57,61.23 71.75,58.42 67.31,58.42 R48.1 R46.2
N$73
  Top 1.016: R46.1 60.64,59.69 R47.1 58.74,61.28 58.1,60.64 58.1,55.98 C48.P$2
N$74
  Top 2.032: PR6.2 73.23,56.59 C47.P$3
N$75  (1 unrouted)
  Top 0.762: U1.P$8 34.58,54.27 33.97,53.66 33.97,45.72 35.24,44.45 52.39,44.45 | 52.39,44.45 74.93,44.45 | R56.1 52.39,50.8 52.39,44.45
  Top 1.016: 74.93,44.45 74.93,43.81
  Top 2.032: PR6.1 69.64,52.5 PR5.2 69.53,51.12 R51.2 74.93,51.12 74.93,44.45 | 74.93,43.81 74.93,40.01 78.11,40.01 78.11,19.68
N$77  (5 unrouted)
N$84
  Top 0.762: R51.1 C15.2
N$85
  Top 0.762: C6.+ 22.86,49.53 22.54,49.85 22.54,53.66 R52.2
  Bottom 0.762: C6.+ 26.04,49.53 30.48,45.09 34.29,45.09 35.24,46.04 U1.P2
N$110
  Top 2.032: PR5.1 64.45,57.3 C48.P$1
RIGHT
  Bottom 0.762: R1.2 27.3,53.98 23.81,53.98 21.59,51.75 21.59,40.64 19.37,40.64 19.37,33.66 J1.1
V+  (via drill 0.6)  (6 unrouted)
  Top 0.762: C19.1 28.89,45.09 30.48,43.5 35.77,43.5 U2.P15
  Top 1.016: U1.P15 37.78,68.63 | U1.P15 42.34,64.88 | 37.78,64.77 U1.P15 | 41.91,43.18 37.78,43.18 U2.P15 | 41.91,43.18 72.71,43.18 v72.71,42.55 | C25.1 67.31,41.27 C23.+ 71.71,40.01 C50.P$1 | C17.+ 41.91,43.18 | C5.1 37.78,66.04 U1.P15
  Top 1.524: 42.34,64.88 C4.+
  Top 2.032: U$5.4 37.78,68.63 80.64,68.63 80.64,64.45 | 80.64,64.45 80.64,42.55 | 80.64,42.55 80.64,17.14 | 80.64,64.45 80.22,64.88 74.57,64.88 C47.P$1 | 74.57,64.77 C47.P$1 | C47.P$1 73.78,64.14 C12.+ 68.9,64.14 C11.1 | v77.15,42.55 80.64,42.55 | C50.P$1 71.71,41.55 v72.71,42.55
  Bottom 2.032: v72.71,42.55 v77.15,42.55
V-  (6 unrouted)
  Top 1.016: C3.2 31.75,62.87 C2.-
  Bottom 0.762: C24.- 54.74,24.13 C49.P$3 55.02,28.57 C26.2 | C18.2 30.48,42.55 31.75,41.27 | C16.- 31.75,38.42
  Bottom 1.016: U1.P10 33.34,56.2 33.34,58.42 | 33.34,58.42 33.34,67.63 | 31.75,33.97 31.75,34.29 | 31.75,34.29 31.75,38.42 31.75,41.27 31.75,41.91 36.51,44.45 52.07,44.45 C14.- | U2.P10 33.24,34.39 31.75,34.29 | C2.- 33.34,58.42
  Bottom 2.032: 79.69,48.58 79.69,67.63 33.34,67.63 23.18,67.63 23.18,60.38 U$5.3 | 79.69,48.58 79.69,25.08 57.15,25.08 57.15,26.49 C49.P$3 | 79.69,48.58 61.23,48.58 C48.P$3 57.15,50.3 | 57.15,50.3 C13.2 | C14.- 57.15,50.3